# EAGLE design tb-4 (EAGLE 7.5.0)
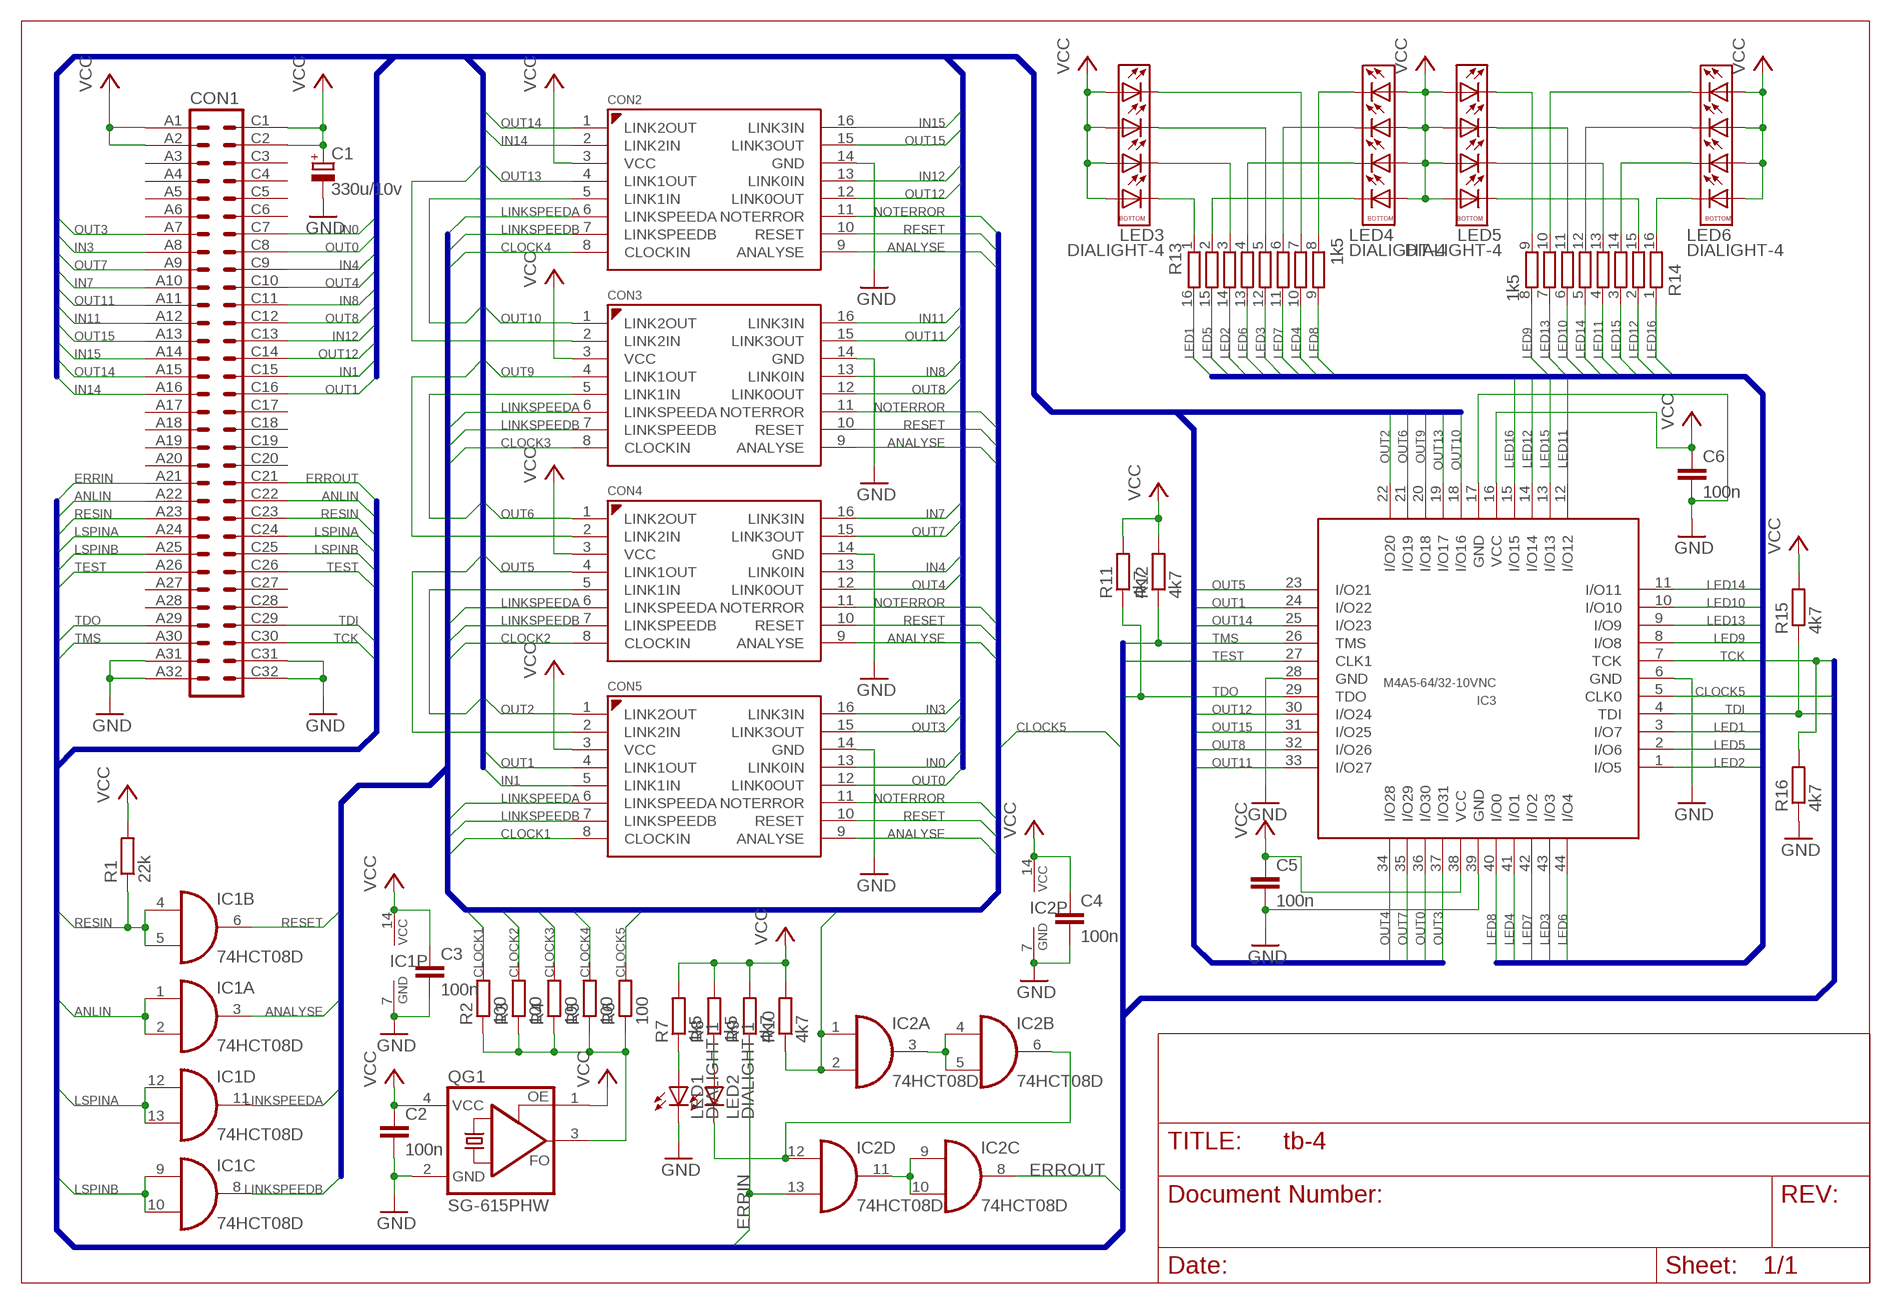
[diagram p0: schematic, sheet 1]

## Parts
C1  330u/10v  CPOL-EUSMCE  [SMC_E]
C2  100n  C-EUC1206  [C1206]
C3  100n  C-EUC1206  [C1206]
C4  100n  C-EUC1206  [C1206]
C5  100n  C-EUC1206  [C1206]
C6  100n  C-EUC1206  [C1206]
CON1  HARTING 09 03 164 6921  EUROPAKARTE-VG32-AC-TB4  [EUROPAKARTE-TB4]
CON2  TRAM-1  [TRAM-1-MB]
CON3  TRAM-1  [TRAM-1-MB]
CON4  TRAM-1  [TRAM-1-MB]
CON5  TRAM-1  [TRAM-1-MB]
IC1  74HCT08D  74HC08D  [SO14]
IC2  74HCT08D  74HC08D  [SO14]
IC3  M4A5-64/32-10VNC  LATTICE-M4A-6432  [TQFP-44]
LED1  DIALIGHT-1  [DIALIGHT-1]
LED2  DIALIGHT-1  [DIALIGHT-1]
LED3  DIALIGHT-4  [DIALIGHT-4]
LED4  DIALIGHT-4  [DIALIGHT-4]
LED5  DIALIGHT-4  [DIALIGHT-4]
LED6  DIALIGHT-4  [DIALIGHT-4]
QG1  SG-615PHW  [SG-615]
R1  22k  R-EU_R1206  [R1206]
R2  100  R-EU_R1206  [R1206]
R3  100  R-EU_R1206  [R1206]
R4  100  R-EU_R1206  [R1206]
R5  100  R-EU_R1206  [R1206]
R6  100  R-EU_R1206  [R1206]
R7  1k5  R-EU_R1206  [R1206]
R8  1k5  R-EU_R1206  [R1206]
R9  4k7  R-EU_R1206  [R1206]
R10  4k7  R-EU_R1206  [R1206]
R11  4k7  R-EU_R1206  [R1206]
R12  4k7  R-EU_R1206  [R1206]
R13  1k5  4816P-T01  [4816P]
R14  1k5  4816P-T01  [4816P]
R15  4k7  R-EU_R1206  [R1206]
R16  4k7  R-EU_R1206  [R1206]

## Nets
ANALYSE: CON2.9(ANALYSE) CON3.9(ANALYSE) CON4.9(ANALYSE) CON5.9(ANALYSE) IC1.3(A:O)
ANLIN: CON1.A22 CON1.C22 IC1.1(A:I0) IC1.2(A:I1)
CLOCK1: CON5.8(CLOCKIN) R2.2
CLOCK2: CON4.8(CLOCKIN) R3.2
CLOCK3: CON3.8(CLOCKIN) R4.2
CLOCK4: CON2.8(CLOCKIN) R5.2
CLOCK5: IC3.5(CLK0) R6.2
ERRIN: CON1.A21 IC2.13(D:I1) R9.1
ERROUT: CON1.C21 IC2.8(C:O)
GND: C1.- C2.2 C3.2 C4.2 C5.2 C6.2 CON1.A31 CON1.A32 CON1.C31 CON1.C32 CON2.14(GND) CON3.14(GND) CON4.14(GND) CON5.14(GND) IC1.7(P:GND) IC2.7(P:GND) IC3.6(GND) IC3.17(GND) IC3.28(GND) IC3.39(GND) LED1.C1(C) QG1.2(GND) R16.1
IN0: CON1.C7 CON5.13(LINK0IN)
IN1: CON1.C15 CON5.5(LINK1IN)
IN3: CON1.A8 CON5.16(LINK3IN)
IN4: CON1.C9 CON4.13(LINK0IN)
IN7: CON1.A10 CON4.16(LINK3IN)
IN8: CON1.C11 CON3.13(LINK0IN)
IN11: CON1.A12 CON3.16(LINK3IN)
IN12: CON1.C13 CON2.13(LINK0IN)
IN14: CON1.A16 CON2.2(LINK2IN)
IN15: CON1.A14 CON2.16(LINK3IN)
LED1: IC3.3(I/O7) R13.16
LED2: IC3.1(I/O5) R13.14
LED3: IC3.43(I/O3) R13.12
LED4: IC3.41(I/O1) R13.10
LED5: IC3.2(I/O6) R13.15
LED6: IC3.44(I/O4) R13.13
LED7: IC3.42(I/O2) R13.11
LED8: IC3.40(I/O0) R13.9
LED9: IC3.8(I/O8) R14.8
LED10: IC3.10(I/O10) R14.6
LED11: IC3.12(I/O12) R14.4
LED12: IC3.14(I/O14) R14.2
LED13: IC3.9(I/O9) R14.7
LED14: IC3.11(I/O11) R14.5
LED15: IC3.13(I/O13) R14.3
LED16: IC3.15(I/O15) R14.1
LINKSPEEDA: CON2.6(LINKSPEEDA) CON3.6(LINKSPEEDA) CON4.6(LINKSPEEDA) CON5.6(LINKSPEEDA) IC1.11(D:O)
LINKSPEEDB: CON2.7(LINKSPEEDB) CON3.7(LINKSPEEDB) CON4.7(LINKSPEEDB) CON5.7(LINKSPEEDB) IC1.8(C:O)
LSPINA: CON1.A24 CON1.C24 IC1.12(D:I0) IC1.13(D:I1)
LSPINB: CON1.A25 CON1.C25 IC1.9(C:I0) IC1.10(C:I1)
N$1: QG1.3(FO) R2.1 R3.1 R4.1 R5.1 R6.1
N$2: LED2.A1(A) R8.1
N$3: IC2.3(A:O) IC2.4(B:I0) IC2.5(B:I1)
N$4: LED1.A1(A) R7.1
N$5: LED3.C1 R13.1
N$6: LED4.C1 R13.2
N$7: LED3.C2 R13.3
N$8: LED4.C2 R13.4
N$9: LED4.C3 R13.6
N$10: LED4.C4 R13.8
N$11: LED3.C4 R13.7
N$12: LED3.C3 R13.5
N$13: LED5.C1 R14.15
N$14: LED6.C1 R14.16
N$15: LED6.C2 R14.14
N$16: LED5.C2 R14.13
N$17: LED6.C3 R14.12
N$18: LED5.C3 R14.11
N$19: LED6.C4 R14.10
N$20: LED5.C4 R14.9
N$22: IC2.9(C:I0) IC2.10(C:I1) IC2.11(D:O)
N$23: IC2.6(B:O) IC2.12(D:I0) LED2.C1(C)
NOTERROR: CON2.11(NOTERROR) CON3.11(NOTERROR) CON4.11(NOTERROR) CON5.11(NOTERROR) IC2.1(A:I0) IC2.2(A:I1) R10.1
OUT0: CON1.C8 CON5.12(LINK0OUT) IC3.36(I/O30)
OUT1: CON1.C16 CON5.4(LINK1OUT) IC3.24(I/O22)
OUT2: CON4.5(LINK1IN) CON5.1(LINK2OUT) IC3.22(I/O20)
OUT3: CON1.A7 CON5.15(LINK3OUT) IC3.37(I/O31)
OUT4: CON1.C10 CON4.12(LINK0OUT) IC3.34(I/O28)
OUT5: CON4.4(LINK1OUT) CON5.2(LINK2IN) IC3.23(I/O21)
OUT6: CON3.5(LINK1IN) CON4.1(LINK2OUT) IC3.21(I/O19)
OUT7: CON1.A9 CON4.15(LINK3OUT) IC3.35(I/O29)
OUT8: CON1.C12 CON3.12(LINK0OUT) IC3.32(I/O26)
OUT9: CON3.4(LINK1OUT) CON4.2(LINK2IN) IC3.20(I/O18)
OUT10: CON2.5(LINK1IN) CON3.1(LINK2OUT) IC3.18(I/O16)
OUT11: CON1.A11 CON3.15(LINK3OUT) IC3.33(I/O27)
OUT12: CON1.C14 CON2.12(LINK0OUT) IC3.30(I/O24)
OUT13: CON2.4(LINK1OUT) CON3.2(LINK2IN) IC3.19(I/O17)
OUT14: CON1.A15 CON2.1(LINK2OUT) IC3.25(I/O23)
OUT15: CON1.A13 CON2.15(LINK3OUT) IC3.31(I/O25)
RESET: CON2.10(RESET) CON3.10(RESET) CON4.10(RESET) CON5.10(RESET) IC1.6(B:O)
RESIN: CON1.A23 CON1.C23 IC1.4(B:I0) IC1.5(B:I1) R1.1
TCK: CON1.C30 IC3.7(TCK) R16.2
TDI: CON1.C29 IC3.4(TDI) R15.1
TDO: CON1.A29 IC3.29(TDO) R11.1
TEST: CON1.A26 CON1.C26 IC3.27(CLK1)
TMS: CON1.A30 IC3.26(TMS) R12.1
VCC: C1.+ C2.1 C3.1 C4.1 C5.1 C6.1 CON1.A1 CON1.A2 CON1.C1 CON1.C2 CON2.3(VCC) CON3.3(VCC) CON4.3(VCC) CON5.3(VCC) IC1.14(P:VCC) IC2.14(P:VCC) IC3.16(VCC) IC3.38(VCC) LED3.A1 LED3.A2 LED3.A3 LED3.A4 LED4.A1 LED4.A2 LED4.A3 LED4.A4 LED5.A1 LED5.A2 LED5.A3 LED5.A4 LED6.A1 LED6.A2 LED6.A3 LED6.A4 QG1.1(OE) QG1.4(VCC) R1.2 R7.2 R8.2 R9.2 R10.2 R11.2 R12.2 R15.2
Unconnected: CON1.A3 CON1.A4 CON1.A5 CON1.A6 CON1.A17 CON1.A18 CON1.A19 CON1.A20 CON1.A27 CON1.A28 CON1.C3 CON1.C4 CON1.C5 CON1.C6 CON1.C17 CON1.C18 CON1.C19 CON1.C20 CON1.C27 CON1.C28

## Buses
IN[0..15],OUT[0..15]
LINKSPEEDA,LINKSPEEDB,CLOCK[1..5],RESET,ANALYSE,NOTERROR
LED[1..16]
ERRIN,ERROUT,ANLIN,RESIN,LSPINA,LSPINB,TDI,TCK,TDO,TMS,TEST,CLOCK5

## Library data of the parts
C1 = rcl:CPOL-EU: POLARIZED CAPACITOR, European symbol
C2-C6 = rcl:C-EU: CAPACITOR, European symbol
CON1 = Transputer:EUROPAKARTE-VG32-AC
CON2-CON5 = Transputer:TRAM-1
IC1 IC2 = 74xx-eu:74*08: Quad 2-input AND gate
IC3 = Transputer:LATTICE-M4A-6432
LED1 LED2 = Transputer:DIALIGHT-1
LED3-LED6 = Transputer:DIALIGHT-4
QG1 = crystal:SG-615: SOJ HIGH-FREQUENCY CRYSTAL OSCILLATOR Source: Crystal Oscillator SG-615%20Series.pdf; OC_FARNELL: unknown; OC_NEWARK: unknown
R1-R12 R15 R16 = rcl:R-EU_: RESISTOR, European symbol
R13 R14 = resistor-bourns:4816P-T01: BOURNS RESISTOR NETWORK; MF: BOURNS, INC.; MPN: 4816P-T01-684LF; OC_FARNELL: 9357483; OC_NEWARK: 33K0707

## Board
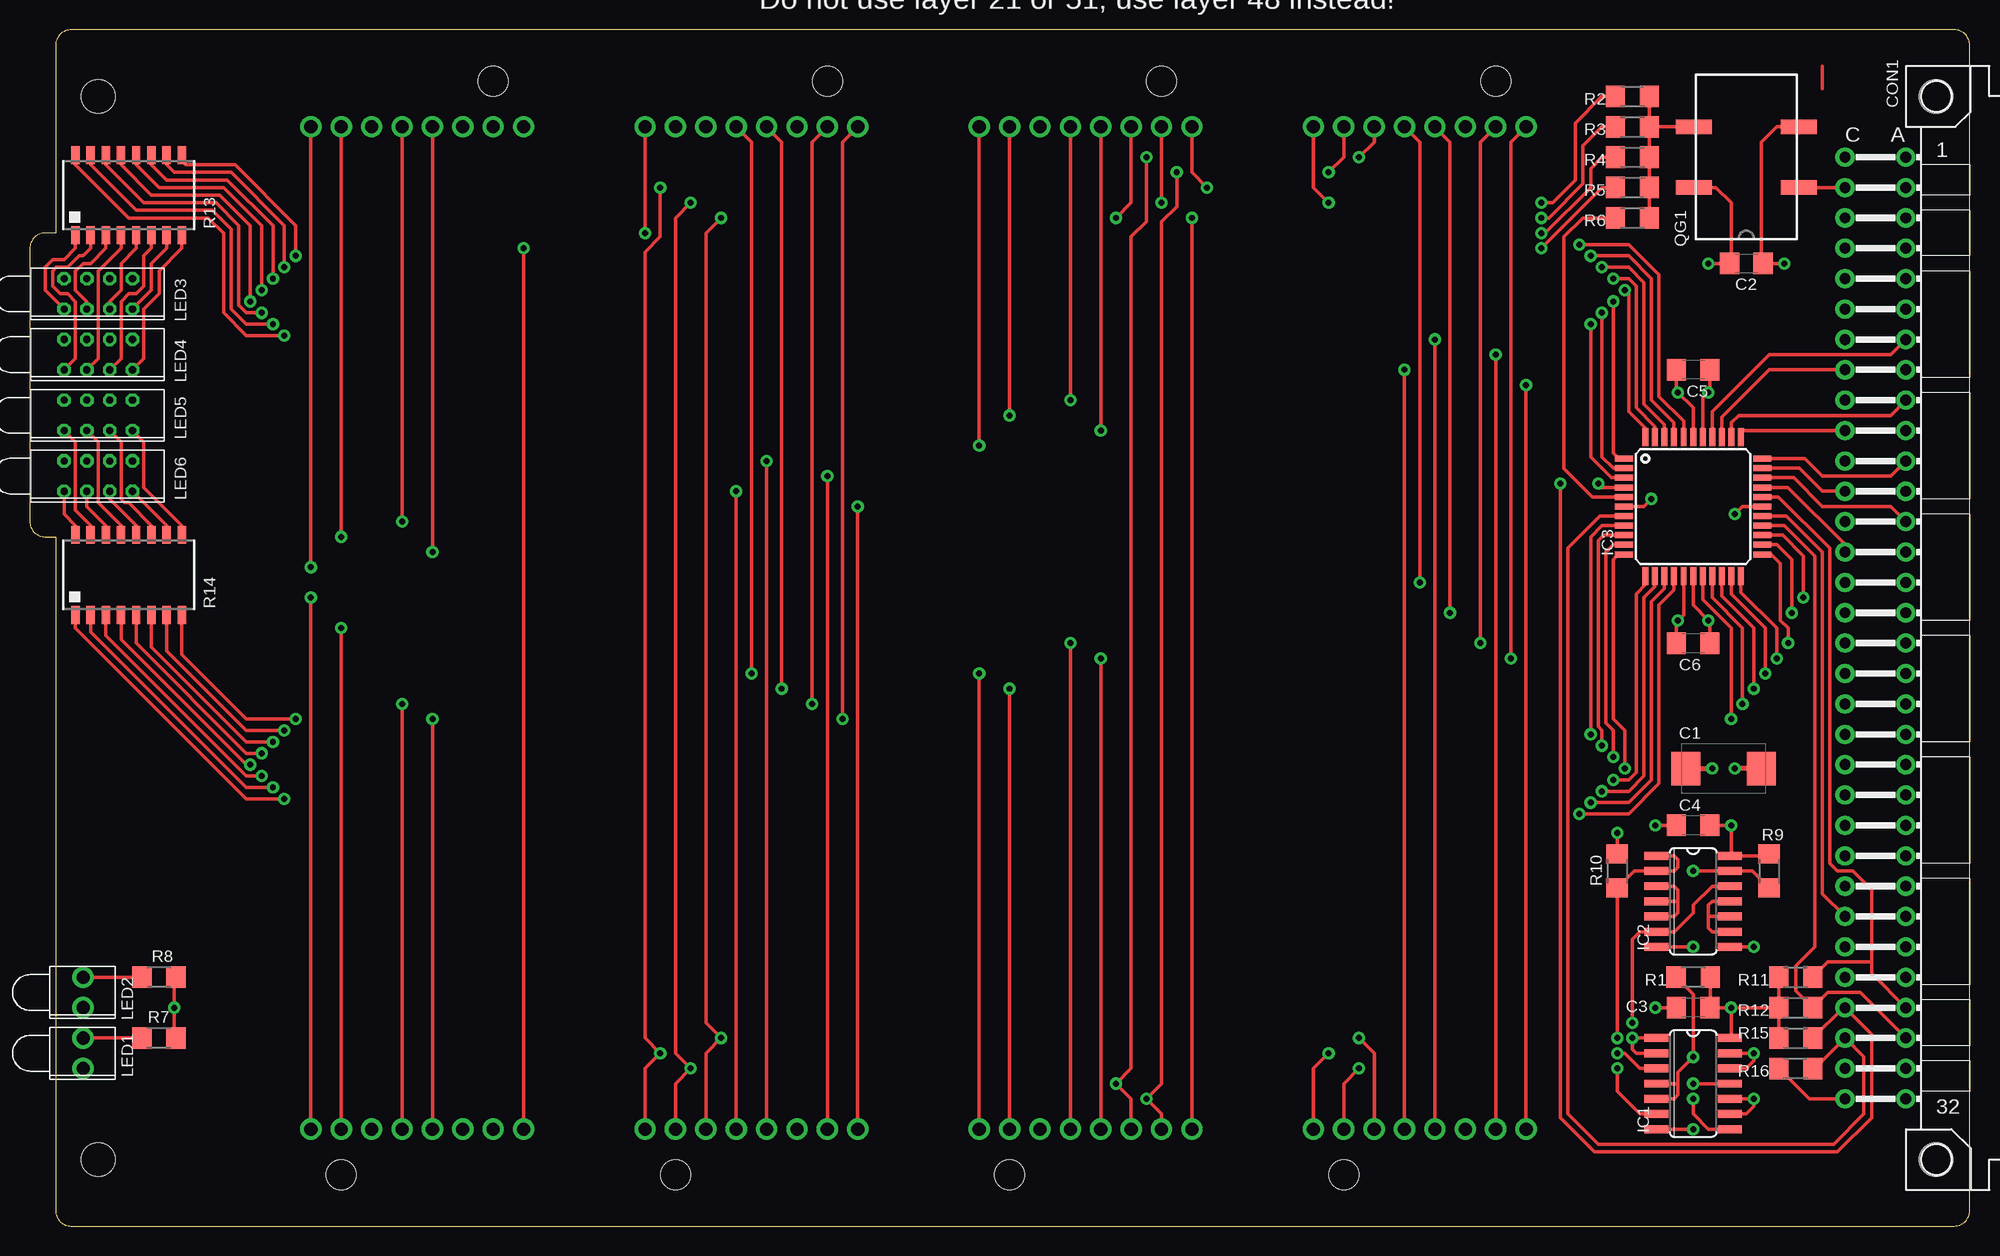
[diagram p1: board, top side]
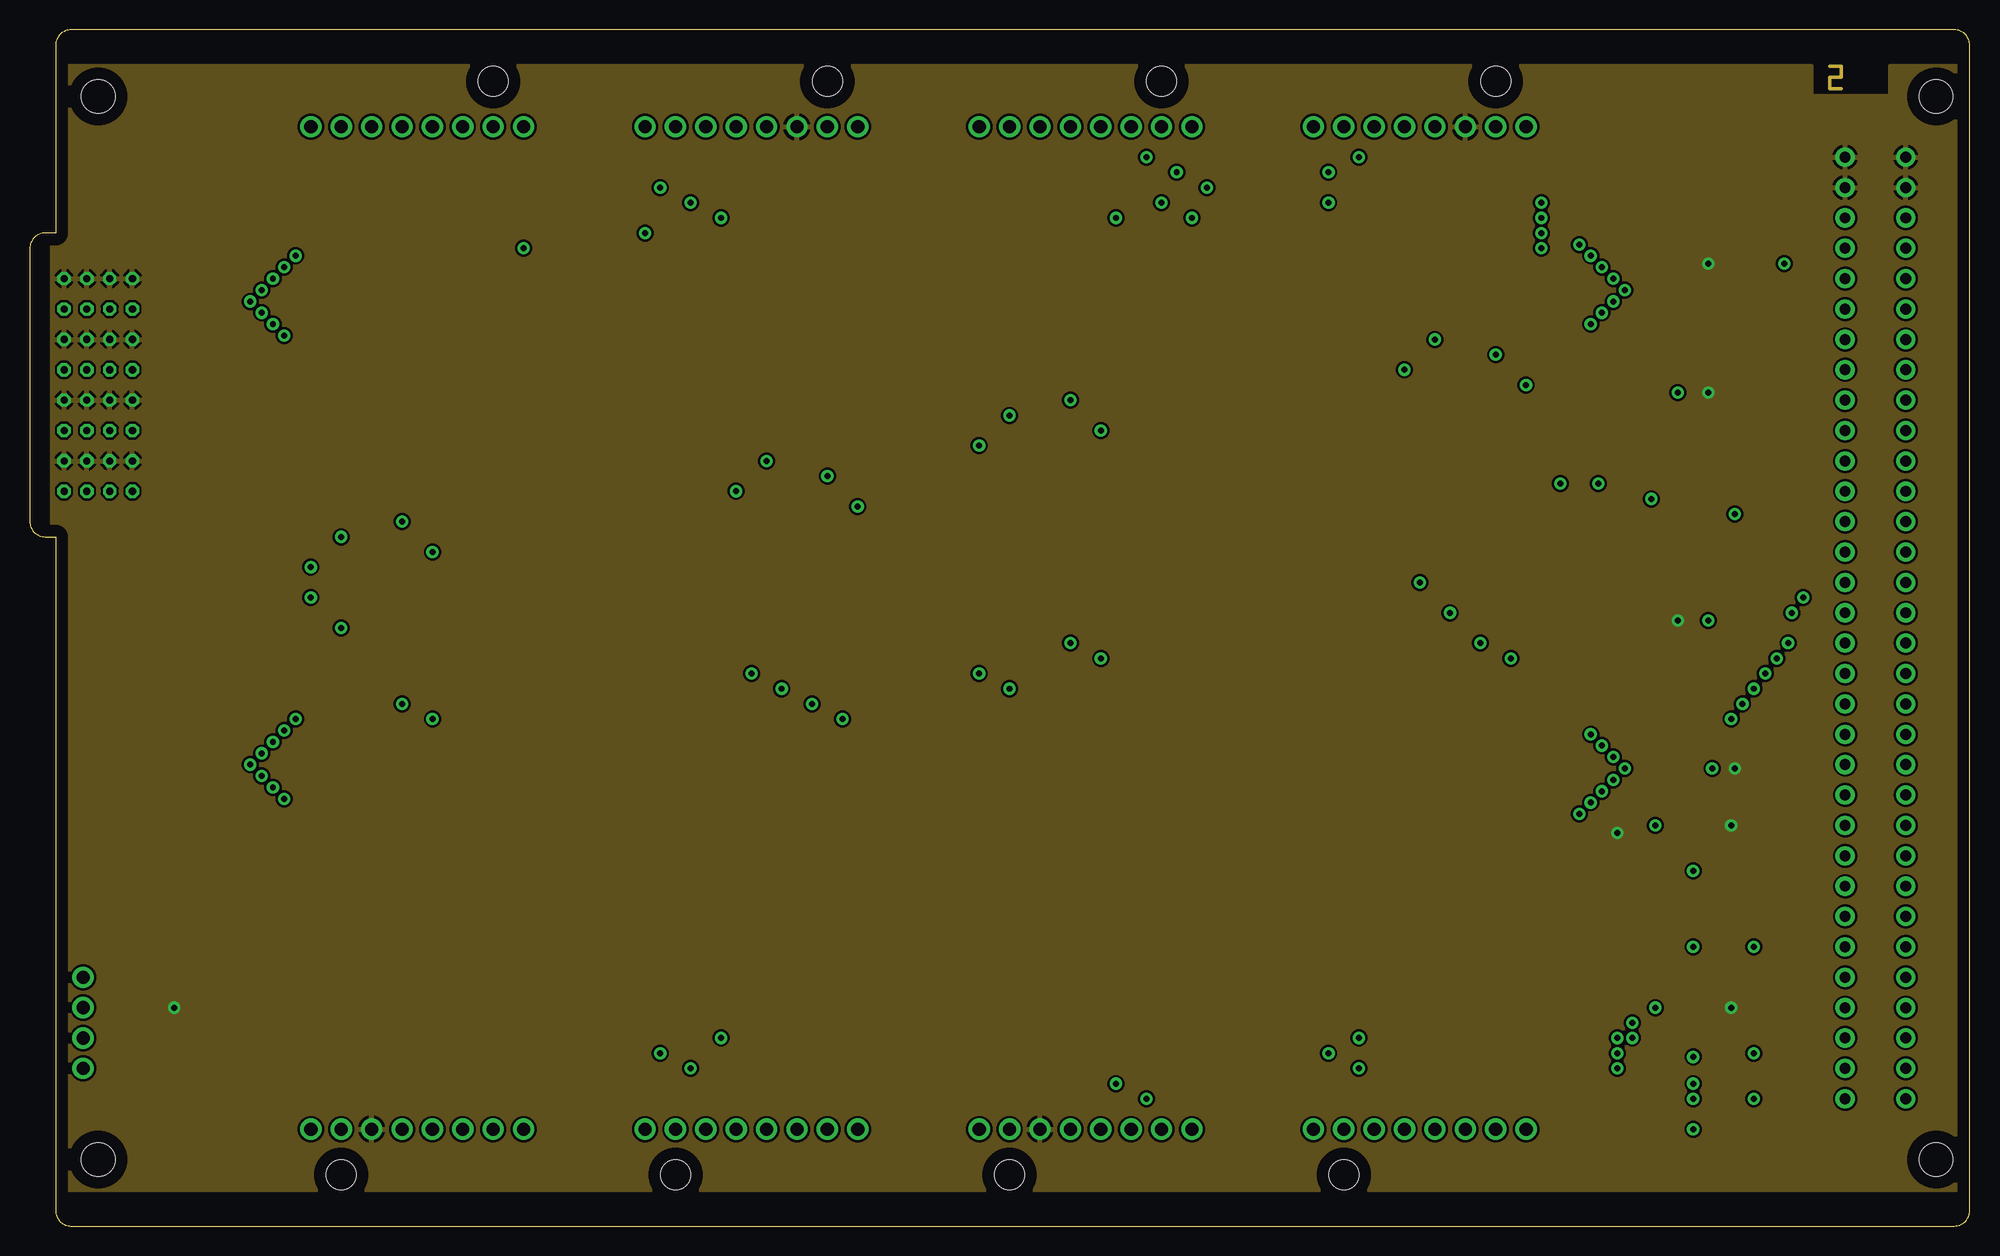
[diagram p2: board, inner layer Route2]
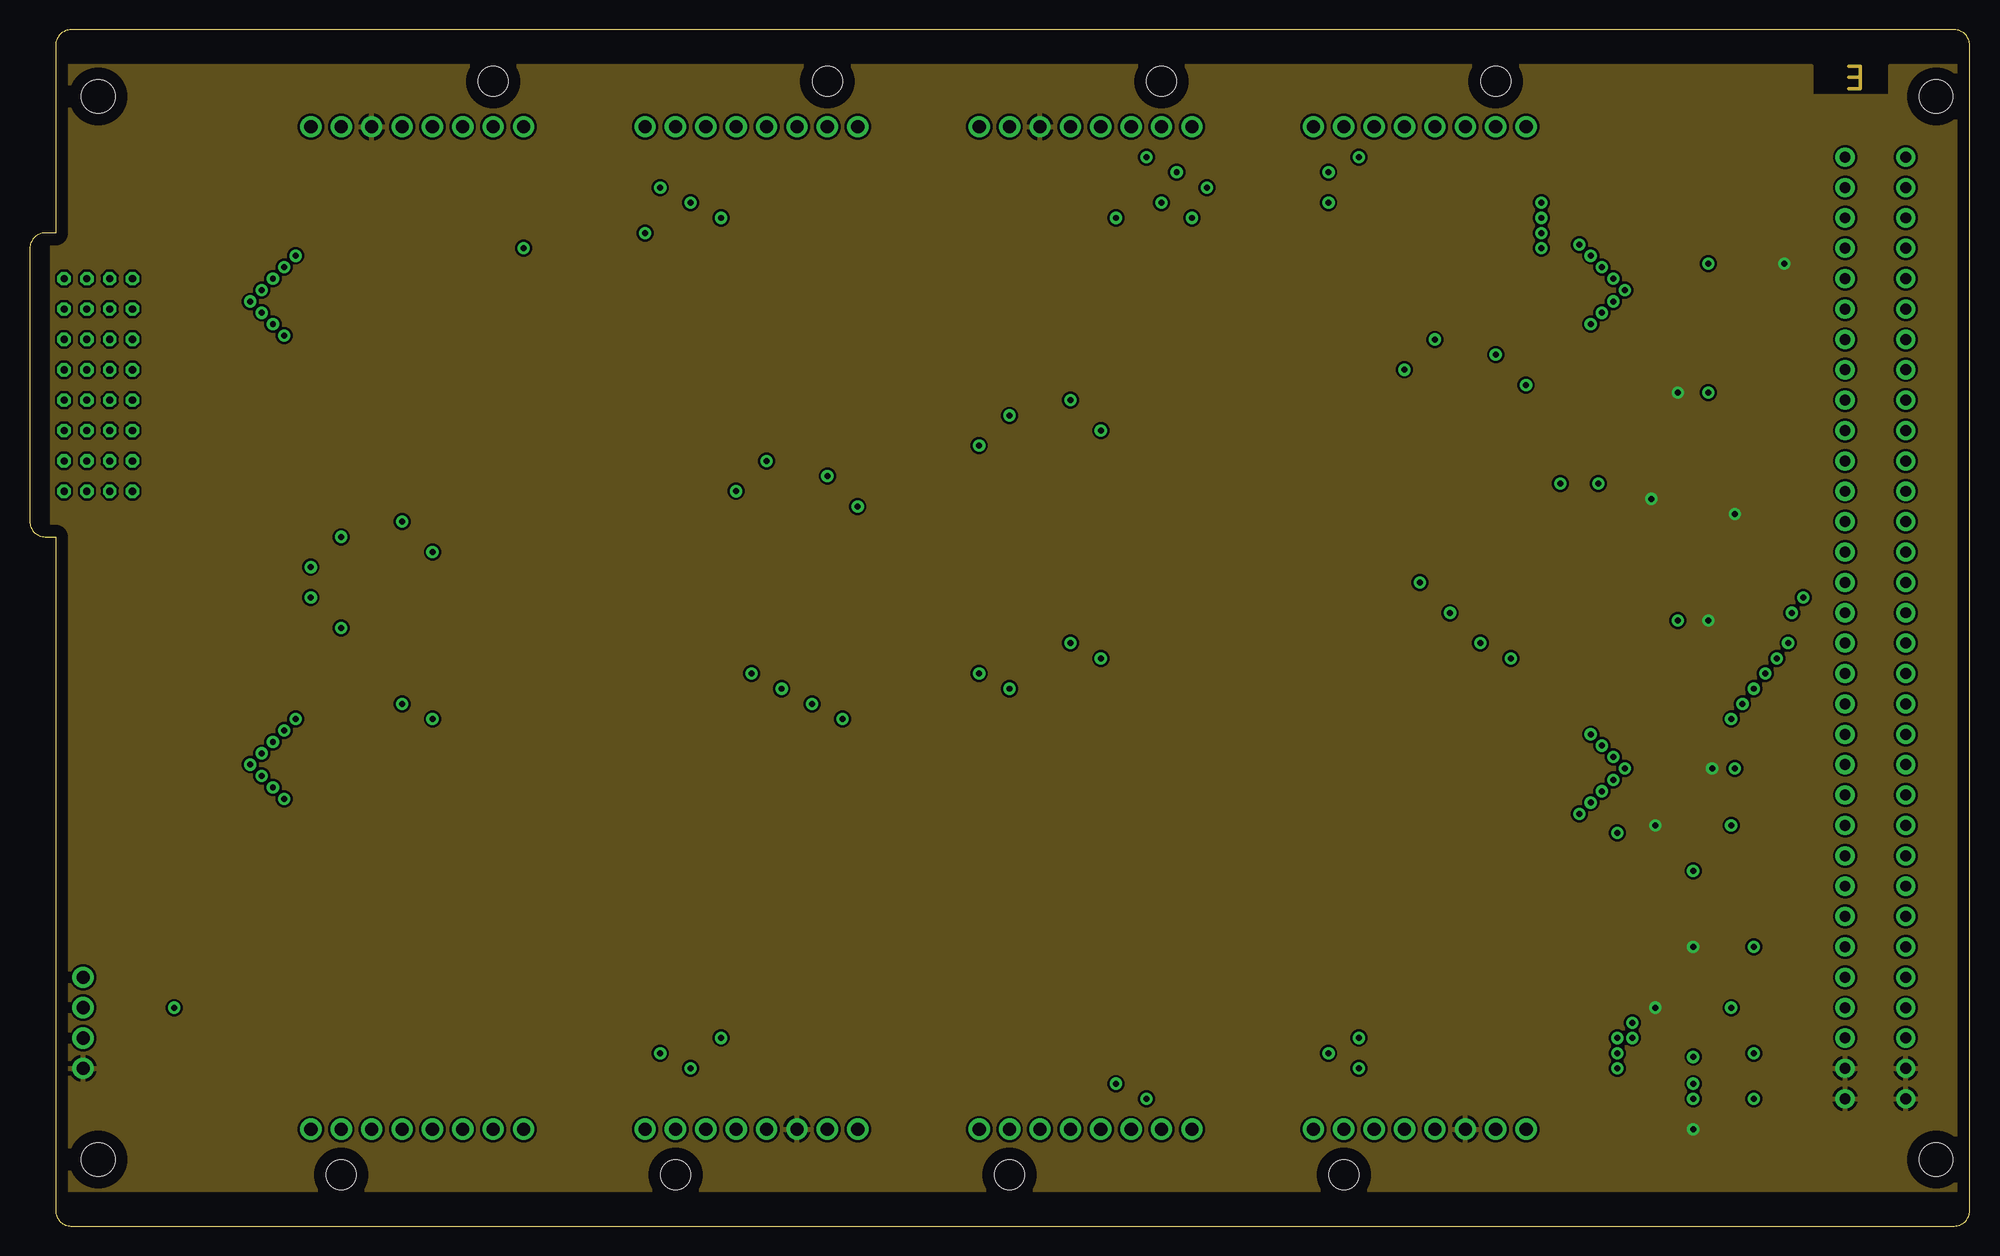
[diagram p3: board, inner layer Route15]
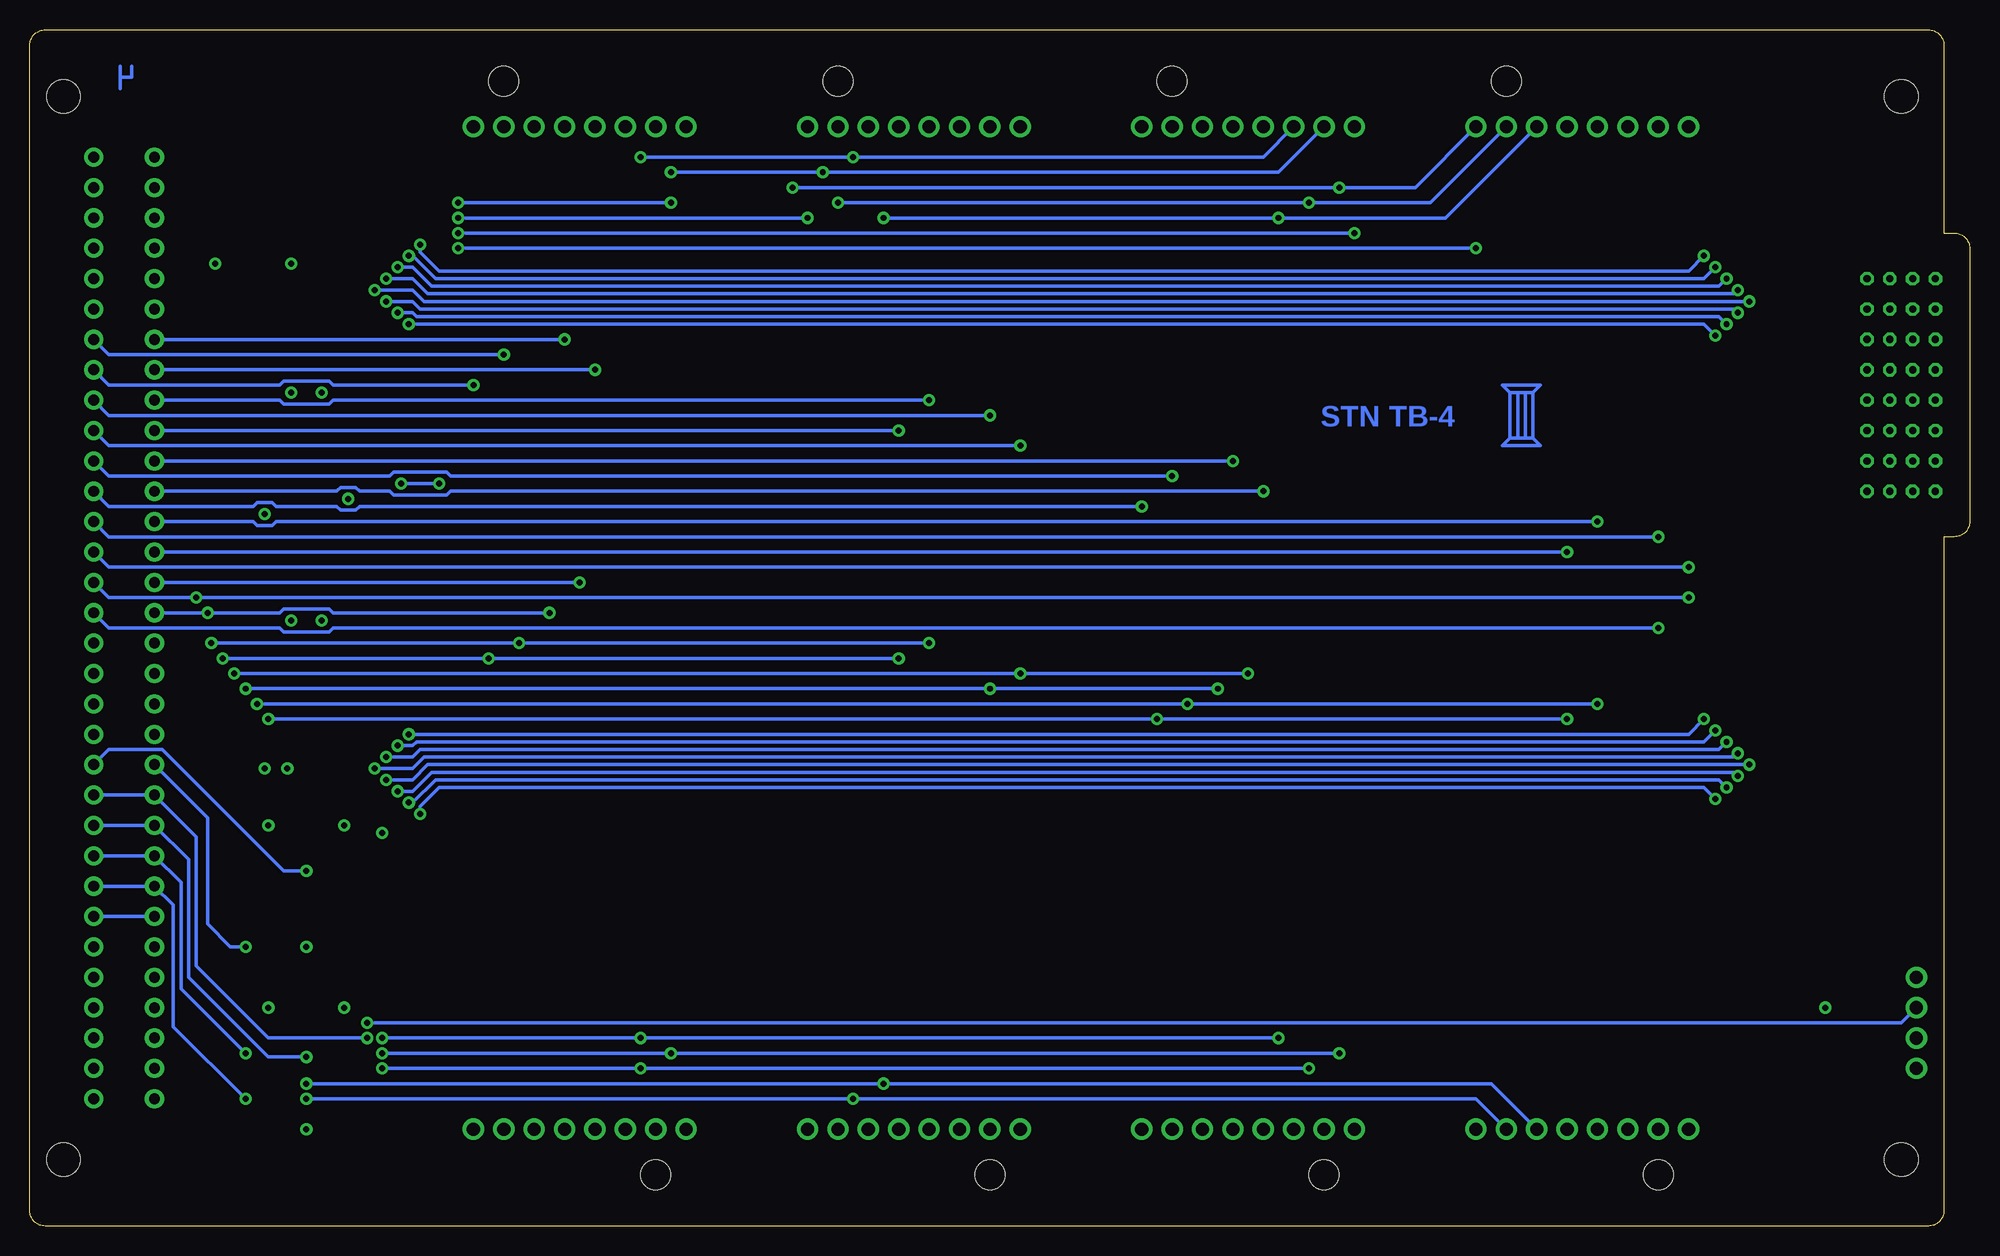
[diagram p4: board, bottom side, seen from below]

Size 162.18 x 100.03 mm. Coordinates in mm from the lower left corner, seen from the top.
Copper layers (1*2*15*16): Top 0.035mm / dielectric 1.5mm / Route2 0.035mm / dielectric 0.15mm / Route15 0.035mm / dielectric 0.2mm / Bottom 0.035mm
Design rules "default *": minimum track width 10mil, minimum drill 16mil, track to track 8mil, track to pad 8mil, pad to pad 8mil, via to via 8mil, smd to smd 8mil, copper to edge 40mil, drill to drill 8mil, minimum pad ring 10mil, minimum via ring 8mil, stop-mask expansion 4mil, vias tented up to drill 0mil, thermal gap 10mil

### Footprints (pad centres in the part's own frame; a part is rotated, then mirrored left to right if it is on the bottom)
SMC_E = smd 2.4 x 2.8: + -3.15,0; - 3.15,0
C1206 = smd 1.6 x 1.8: 1 -1.4,0; 2 1.4,0
EUROPAKARTE-TB4 = drill 0.914 pad 1.6: A1 71.12,39.37; A2 71.12,36.83; A3 71.12,34.29; A4 71.12,31.75; A5 71.12,29.21; A6 71.12,26.67; A7 71.12,24.13; A8 71.12,21.59; A9 71.12,19.05; A10 71.12,16.51; A11 71.12,13.97; A12 71.12,11.43; A13 71.12,8.89; A14 71.12,6.35; A15 71.12,3.81; A16 71.12,1.27; A17 71.12,-1.27; A18 71.12,-3.81; A19 71.12,-6.35; A20 71.12,-8.89; A21 71.12,-11.43; A22 71.12,-13.97; A23 71.12,-16.51; A24 71.12,-19.05; A25 71.12,-21.59; A26 71.12,-24.13; A27 71.12,-26.67; A28 71.12,-29.21; A29 71.12,-31.75; A30 71.12,-34.29; A31 71.12,-36.83; A32 71.12,-39.37; C1 66.04,39.37; C2 66.04,36.83; C3 66.04,34.29; C4 66.04,31.75; C5 66.04,29.21; C6 66.04,26.67; C7 66.04,24.13; C8 66.04,21.59; C9 66.04,19.05; C10 66.04,16.51; C11 66.04,13.97; C12 66.04,11.43; C13 66.04,8.89; C14 66.04,6.35; C15 66.04,3.81; C16 66.04,1.27; C17 66.04,-1.27; C18 66.04,-3.81; C19 66.04,-6.35; C20 66.04,-8.89; C21 66.04,-11.43; C22 66.04,-13.97; C23 66.04,-16.51; C24 66.04,-19.05; C25 66.04,-21.59; C26 66.04,-24.13; C27 66.04,-26.67; C28 66.04,-29.21; C29 66.04,-31.75; C30 66.04,-34.29; C31 66.04,-36.83; C32 66.04,-39.37 | hole 2.794: 73.66,44.45; 73.66,-44.45; -80.01,-44.45; -80.01,44.45
TRAM-1-MB = drill 1.1 pad 1.778: 1 0,0; 2 2.54,0; 3 5.08,0; 4 7.62,0; 5 10.16,0; 6 12.7,0; 7 15.24,0; 8 17.78,0; 9 17.78,83.82; 10 15.24,83.82; 11 12.7,83.82; 12 10.16,83.82; 13 7.62,83.82; 14 5.08,83.82; 15 2.54,83.82; 16 0,83.82 | hole 2.5: 2.54,-3.81; 15.24,87.63
SO14 = smd 0.66 x 2.032: 1 -3.81,-3.073; 2 -2.54,-3.073; 3 -1.27,-3.073; 4 0,-3.073; 5 1.27,-3.073; 6 2.54,-3.073; 7 3.81,-3.073; 8 3.81,3.073; 9 2.54,3.073; 10 1.27,3.073; 11 0,3.073; 12 -1.27,3.073; 13 -2.54,3.073; 14 -3.81,3.073
TQFP-44 = smd 1.5 x 0.5: 1 -5.8,4; 2 -5.8,3.2; 3 -5.8,2.4; 4 -5.8,1.6; 5 -5.8,0.8; 6 -5.8,0; 7 -5.8,-0.8; 8 -5.8,-1.6; 9 -5.8,-2.4; 10 -5.8,-3.2; 11 -5.8,-4; 23 5.8,-4; 24 5.8,-3.2; 25 5.8,-2.4; 26 5.8,-1.6; 27 5.8,-0.8; 28 5.8,0; 29 5.8,0.8; 30 5.8,1.6; 31 5.8,2.4; 32 5.8,3.2; 33 5.8,4 | smd 0.5 x 1.5: 12 -4,-5.8; 13 -3.2,-5.8; 14 -2.4,-5.8; 15 -1.6,-5.8; 16 -0.8,-5.8; 17 0,-5.8; 18 0.8,-5.8; 19 1.6,-5.8; 20 2.4,-5.8; 21 3.2,-5.8; 22 4,-5.8; 34 4,5.8; 35 3.2,5.8; 36 2.4,5.8; 37 1.6,5.8; 38 0.8,5.8; 39 0,5.8; 40 -0.8,5.8; 41 -1.6,5.8; 42 -2.4,5.8; 43 -3.2,5.8; 44 -4,5.8
DIALIGHT-1 = drill 1.1 pad 1.778: A1 0,1.27; C1 0,-1.27
DIALIGHT-4 = drill 0.6 pad 1.016 octagon: A1 0,1.27; A2 1.905,1.27; A3 3.81,1.27; A4 5.715,1.27; C1 0,-1.27; C2 1.905,-1.27; C3 3.81,-1.27; C4 5.715,-1.27
SG-615 = smd 1.2 x 3: 1 -2.54,-4.4; 2 2.54,-4.4; 3 2.54,4.4; 4 -2.54,4.4
R1206 = smd 1.6 x 1.803: 1 -1.422,0; 2 1.422,0
4816P = smd 0.7 x 1.5: 1 -4.445,-3.346; 2 -3.175,-3.346; 3 -1.905,-3.346; 4 -0.635,-3.346; 5 0.635,-3.346; 6 1.905,-3.346; 7 3.175,-3.346; 8 4.445,-3.346; 9 4.445,3.346; 10 3.175,3.346; 11 1.905,3.346; 12 0.635,3.346; 13 -0.635,3.346; 14 -1.905,3.346; 15 -3.175,3.346; 16 -4.445,3.346

### Placement (x,y rotation side)
C1  141.6,38.27 180 top
C2  143.51,80.49 0 top
C3  139.06,18.26 180 top
C4  139.06,33.5 180 top
C5  139.06,71.6 180 top
C6  139.06,48.74 0 top
CON1  85.72,50.01 0 top
CON2  23.5,8.1 0 top
CON3  69.22,91.92 180 top
CON4  79.38,8.1 0 top
CON5  125.09,91.92 180 top
IC1  139.06,11.91 270 top
IC2  139.06,27.15 270 top
IC3  139.06,60.17 0 top
LED1  4.45,14.45 0 top
LED2  4.45,19.53 0 top
LED3  2.86,77.95 0 top
LED4  2.86,72.87 0 top
LED5  2.86,67.79 0 top
LED6  2.86,62.71 0 top
QG1  143.51,89.38 90 top
R1  139.06,20.8 0 top
R2  133.99,94.46 180 top
R3  133.99,91.92 180 top
R4  133.99,89.38 180 top
R5  133.99,86.84 180 top
R6  133.99,84.3 180 top
R7  10.8,15.72 0 top
R8  10.8,20.8 0 top
R9  145.41,29.69 90 top
R10  132.72,29.69 90 top
R11  147.64,20.8 180 top
R12  147.64,18.26 180 top
R13  8.26,86.21 0 top
R14  8.26,54.46 0 top
R15  147.64,15.72 180 top
R16  147.64,13.18 0 top
U$2  [LOGO]  37.47,67.79 0 bottom
U$3  [LAYER14]  152.08,96.05 0 top

### Tracks (layer width: path | path; a pad name or v marks a point on that pad's centre or on a via)
ANALYSE  (via drill 0.5 pad 1.02)
  Top 0.305: CON3.9 51.44,13.18 v52.7,14.45 51.44,15.72 51.44,81.45 52.7,82.72 v52.7,86.84 | CON5.9 107.31,13.18 v108.59,14.45 | v98.42,86.84 97.16,88.11 CON4.9 | IC1.3 134.62,13.18 133.35,14.45 v132.72,14.45
  Bottom 0.305: v52.7,14.45 v108.59,14.45 v132.72,14.45 | CON2.9 46.36,86.84 v52.7,86.84 v98.42,86.84
ANLIN  (via drill 0.5 pad 1.02)
  Top 0.305: IC1.2 134.3,14.45 133.99,14.77 v133.99,15.72 IC1.1
  Bottom 0.305: v133.99,15.72 142.24,15.72 148.27,21.75 148.27,32.55 CON1.C22 CON1.A22
CLOCK1  (via drill 0.5 pad 1.02)
  Top 0.305: CON5.8 107.31,86.84 v108.59,85.57 | R2.2 131.44,94.46 129.22,92.24 129.22,87.48 127.32,85.57 v126.36,85.57
  Bottom 0.305: v108.59,85.57 v126.36,85.57
CLOCK2  (via drill 0.5 pad 1.02)
  Top 0.305: CON4.8 v97.16,84.3 | v126.36,84.3 127,84.3 129.86,87.16 129.86,90.33 131.44,91.92 R3.2
  Bottom 0.305: v97.16,84.3 v126.36,84.3
CLOCK3  (via drill 0.5 pad 1.02)
  Top 0.305: CON3.8 v51.44,83.03 | R4.2 131.44,89.38 130.49,88.43 130.49,86.84 126.68,83.03 v126.36,83.03
  Bottom 0.305: v51.44,83.03 v126.36,83.03
CLOCK4  (via drill 0.5 pad 1.02)
  Top 0.305: CON2.8 v41.27,81.76 | v126.36,81.76 131.44,86.84 R5.2
  Bottom 0.305: v41.27,81.76 v126.36,81.76
CLOCK5
  Top 0.305: IC3.5 130.65,60.97 128.27,63.35 128.27,82.72 129.86,84.3 R6.2
ERRIN  (via drill 0.5 pad 1.02)
  Top 0.305: v139.06,29.69 IC2.13 143.99,29.69 R9.1
  Bottom 0.305: CON1.A21 155.57,39.85 151.13,39.85 140.97,29.69 v139.06,29.69
ERROUT  (via drill 0.5 pad 1.02)
  Top 0.305: IC2.8 v144.15,23.34
  Bottom 0.305: CON1.C21 147.32,34.14 147.32,25.25 145.41,23.34 v144.15,23.34
GND  (via drill 0.5 pad 1.02)
  Top 0.305: QG1.2 146.05,91.92 144.78,90.65 144.78,80.62 | IC3.39 139.06,68.43 v137.79,69.7 137.66,69.83 C5.2 | IC3.6 134.94,60.17 v135.57,60.81 | IC3.28 143.19,60.17 v142.56,59.54 | IC3.17 139.06,51.92 v140.34,50.65 140.47,50.52 C6.2 | IC1.7 v139.06,8.1 | C3.2 v135.89,18.26 | C4.2 v135.89,33.5 | IC2.7 v139.06,23.34 | C2.2 v146.69,80.49 | R16.1 148.76,10.64 CON1.C32
  Top 0.406: C1.- v140.65,38.26
  Top 0.61: 144.78,80.62 C2.2
  pour Route15: 1.91,97 148.91,97 148.91,94.46 155.57,94.46 155.57,97 161.93,97 161.93,3.02 1.91,3.02
IN0  (via drill 0.5 pad 1.02)
  Top 0.305: v117.47,74.14 CON5.13
  Bottom 0.305: CON1.C7 v117.47,74.14
IN1  (via drill 0.5 pad 1.02)
  Top 0.305: CON5.5 116.2,90.65 v116.2,53.82
  Bottom 0.305: CON1.C15 v116.2,53.82
IN3  (via drill 0.5 pad 1.02)
  Top 0.305: v125.09,70.33 CON5.16
  Bottom 0.305: CON1.A8 155.57,70.33 141.29,70.33 140.97,70.65 137.16,70.65 136.84,70.33 v125.09,70.33
IN4  (via drill 0.5 pad 1.02)
  Top 0.305: CON4.13 v87,69.06
  Bottom 0.305: CON1.C9 141.29,69.06 140.97,68.75 137.16,68.75 136.84,69.06 v87,69.06
IN7  (via drill 0.5 pad 1.02)
  Top 0.305: CON4.16 v79.38,65.25
  Bottom 0.305: CON1.A10 155.57,65.25 v79.38,65.25
IN8  (via drill 0.5 pad 1.02)
  Top 0.305: CON3.13 v61.59,63.98
  Bottom 0.305: CON1.C11 v61.59,63.98
IN11  (via drill 0.5 pad 1.02)
  Top 0.305: CON3.16 v69.22,60.17
  Bottom 0.305: CON1.A12 155.57,60.17 143.51,60.17 143.19,60.49 141.92,60.49 141.6,60.17 136.53,60.17 136.21,59.85 134.94,59.85 134.62,60.17 v69.22,60.17
IN12  (via drill 0.5 pad 1.02)
  Top 0.305: CON2.13 v31.12,58.9
  Bottom 0.305: CON1.C13 143.51,58.9 143.19,58.58 141.92,58.58 141.6,58.9 v31.12,58.9
IN14  (via drill 0.5 pad 1.02)
  Top 0.305: CON2.2 v26.04,50.01
  Bottom 0.305: CON1.A16 155.57,50.01 141.29,50.01 140.97,49.69 137.16,49.69 136.84,50.01 v26.04,50.01
IN15  (via drill 0.5 pad 1.02)
  Top 0.305: CON2.16 v23.5,55.09
  Bottom 0.305: CON1.A14 155.57,55.09 v23.5,55.09
LED1  (via drill 0.5 pad 1.02)
  Top 0.305: R13.16 3.81,88.75 8.26,84.3 14.92,84.3 16.19,83.03 16.19,76.36 18.1,74.46 v21.27,74.46 | IC3.3 132.22,62.57 130.49,64.3 v130.49,75.41
  Bottom 0.305: v21.27,74.46 22.23,75.41 v130.49,75.41
LED2  (via drill 0.5 pad 1.02)
  Top 0.305: R13.14 6.35,88.75 9.53,85.57 15.56,85.57 17.46,83.67 17.46,77 18.1,76.36 v19.37,76.36 | IC3.1 132.84,64.17 132.4,64.62 v132.4,77.32
  Bottom 0.305: v19.37,76.36 19.69,76.68 129.54,76.68 130.18,77.32 v132.4,77.32
LED3  (via drill 0.5 pad 1.02)
  Top 0.305: R13.12 8.89,88.75 10.8,86.84 16.19,86.84 19.37,83.67 v19.37,78.27 | IC3.43 135.87,66.86 134.3,68.43 134.3,78.59 133.67,79.22 v132.4,79.22
  Bottom 0.305: v19.37,78.27 19.69,77.95 128.91,77.95 130.18,79.22 v132.4,79.22
LED4  (via drill 0.5 pad 1.02)
  Top 0.305: R13.10 11.43,88.75 12.07,88.11 16.83,88.11 21.27,83.67 v21.27,80.18 | IC3.41 137.47,67.17 135.57,69.06 135.57,79.22 133.67,81.13 v130.49,81.13
  Bottom 0.305: v21.27,80.18 22.23,79.22 128.27,79.22 130.18,81.13 v130.49,81.13
LED5  (via drill 0.5 pad 1.02)
  Top 0.305: R13.15 5.08,88.75 8.89,84.94 15.24,84.94 16.83,83.35 16.83,76.68 18.1,75.41 v20.32,75.41 | IC3.2 132.37,63.37 131.44,64.3 v131.44,76.36
  Bottom 0.305: v20.32,75.41 20.96,76.05 129.86,76.05 130.18,76.36 v131.44,76.36
LED6  (via drill 0.5 pad 1.02)
  Top 0.305: R13.13 7.62,88.75 10.16,86.21 15.88,86.21 18.42,83.67 v18.42,77.32 | IC3.44 135.06,66.71 133.67,68.11 133.67,77.95 v133.35,78.27
  Bottom 0.305: v18.42,77.32 129.22,77.32 130.18,78.27 v133.35,78.27
LED7  (via drill 0.5 pad 1.02)
  Top 0.305: R13.11 10.16,88.75 11.43,87.48 16.51,87.48 20.32,83.67 v20.32,79.22 | IC3.42 136.66,67.02 134.94,68.75 134.94,78.9 133.67,80.18 v131.44,80.18
  Bottom 0.305: v20.32,79.22 20.96,78.59 128.59,78.59 130.18,80.18 v131.44,80.18
LED8  (via drill 0.5 pad 1.02)
  Top 0.305: R13.9 12.7,89.07 13.02,88.75 17.15,88.75 22.23,83.67 v22.23,81.13 | IC3.40 138.27,67.32 136.21,69.38 136.21,79.54 133.67,82.08 v129.54,82.08
  Bottom 0.305: v22.23,81.13 23.5,79.86 127.95,79.86 129.54,81.45 v129.54,82.08
LED9  (via drill 0.5 pad 1.02)
  Top 0.305: R14.8 12.7,47.79 18.1,42.39 v22.23,42.39 | IC3.8 131.43,58.57 130.49,57.63 v130.49,41.12
  Bottom 0.305: v22.23,42.39 23.5,41.12 v130.49,41.12
LED10  (via drill 0.5 pad 1.02)
  Top 0.305: R14.6 10.16,48.43 18.1,40.49 v20.32,40.49 | IC3.10 132.37,56.97 131.76,56.36 131.76,42.07 132.4,41.44 v132.4,39.22
  Bottom 0.305: v20.32,40.49 20.96,39.85 129.54,39.85 130.18,39.22 v132.4,39.22
LED11  (via drill 0.5 pad 1.02)
  Top 0.305: R14.4 7.62,49.06 18.1,38.58 v18.42,38.58 | IC3.12 135.06,53.63 134.3,52.87 134.3,37.95 133.67,37.31 v132.4,37.31
  Bottom 0.305: v18.42,38.58 128.91,38.58 130.18,37.31 v132.4,37.31
LED12  (via drill 0.5 pad 1.02)
  Top 0.305: R14.2 5.08,49.69 18.1,36.68 v20.32,36.68 | IC3.14 136.66,53.33 135.57,52.24 135.57,37.31 133.67,35.41 v130.49,35.41
  Bottom 0.305: v20.32,36.68 20.96,37.31 128.27,37.31 130.18,35.41 v130.49,35.41
LED13  (via drill 0.5 pad 1.02)
  Top 0.305: R14.7 11.43,48.11 18.1,41.44 v21.27,41.44 | IC3.9 131.59,57.77 131.13,57.32 131.13,41.76 131.44,41.44 v131.44,40.17
  Bottom 0.305: v21.27,41.44 22.23,40.49 129.86,40.49 130.18,40.17 v131.44,40.17
LED14  (via drill 0.5 pad 1.02)
  Top 0.305: R14.5 8.89,48.74 18.1,39.54 v19.37,39.54 | IC3.11 132.84,56.17 132.4,55.73 132.4,42.39 133.35,41.44 v133.35,38.26
  Bottom 0.305: v19.37,39.54 19.69,39.22 129.22,39.22 130.18,38.26 v133.35,38.26
LED15  (via drill 0.5 pad 1.02)
  Top 0.305: R14.3 6.35,49.38 18.1,37.63 v19.37,37.63 | IC3.13 135.87,53.48 134.94,52.55 134.94,37.63 133.67,36.36 v131.44,36.36
  Bottom 0.305: v19.37,37.63 19.69,37.95 128.59,37.95 130.18,36.36 v131.44,36.36
LED16  (via drill 0.5 pad 1.02)
  Top 0.305: R14.1 3.81,50.01 18.1,35.73 v21.27,35.73 | IC3.15 137.47,53.18 136.21,51.92 136.21,36.99 133.67,34.46 v129.54,34.46
  Bottom 0.305: v21.27,35.73 22.23,36.68 127.95,36.68 129.54,35.09 v129.54,34.46
LINKSPEEDA  (via drill 0.5 pad 1.02)
  Top 0.305: CON4.6 92.08,10.64 v90.81,11.91 92.08,13.18 92.08,82.72 93.34,83.98 v93.34,89.38 | CON5.6 112.39,90.65 v111.12,89.38 | IC1.11 v139.06,11.91
  Bottom 0.305: CON2.6 40.01,11.91 v90.81,11.91 v139.06,11.91 | CON3.6 59.05,89.38 v93.34,89.38 v111.12,89.38
LINKSPEEDB  (via drill 0.5 pad 1.02)
  Top 0.305: CON4.7 94.61,9.37 v93.34,10.64 94.61,11.91 94.61,83.98 95.89,85.25 v95.89,88.11 | v108.59,88.11 109.86,89.38 CON5.7 | IC1.8 140.34,8.1 139.06,9.37 v139.06,10.64
  Bottom 0.305: CON2.7 41.27,10.64 v93.34,10.64 v139.06,10.64 | CON3.7 57.79,88.11 v95.89,88.11 v108.59,88.11
LSPINA  (via drill 0.5 pad 1.02)
  Top 0.305: IC1.12 143.51,13.18 144.15,13.82 v144.15,14.45 IC1.13
  Bottom 0.305: v144.15,14.45 149.54,19.85 149.54,28.74 CON1.C24 CON1.A24
LSPINB  (via drill 0.5 pad 1.02)
  Top 0.305: IC1.9 143.51,9.37 144.15,10.01 v144.15,10.64 IC1.10
  Bottom 0.305: v144.15,10.64 150.18,16.68 150.18,26.84 CON1.C25 CON1.A25
N$1
  Top 0.305: R3.1 R2.1 | R3.1 R4.1 R5.1 R6.1 | QG1.3 R3.1
N$2
  Top 0.305: 9.53,20.8 R8.1 LED2.A1
N$3
  Top 0.305: IC2.5 137.48,25.88 137.79,26.2 137.79,27.15 | 137.79,27.15 IC2.4 | IC2.3 137.48,28.42 137.79,28.11 137.79,27.15
N$4
  Top 0.305: R7.1 LED1.A1
N$5
  Top 0.305: LED3.C1 1.27,78.27 1.27,80.18 1.91,80.81 2.86,80.81 3.81,81.76 R13.1
N$6
  Top 0.305: R13.2 5.08,81.76 4.45,81.13 4.13,81.13 3.18,80.18 2.22,80.18 1.91,79.86 1.91,78.59 2.54,77.95 3.18,77.95 3.81,77.32 3.81,72.56 LED4.C1
N$7
  Top 0.305: LED3.C2 4.76,77.32 3.81,78.27 3.81,79.86 4.45,80.49 5.08,80.49 6.35,81.76 R13.3
N$8
  Top 0.305: LED4.C2 5.72,72.56 5.72,79.86 7.62,81.76 R13.4
N$9
  Top 0.305: LED4.C3 7.62,72.56 7.62,77.32 8.26,77.95 8.89,77.95 9.53,78.59 9.53,81.13 10.16,81.76 R13.6
N$10
  Top 0.305: R13.8 12.7,81.76 10.8,79.86 10.8,77.95 9.53,76.68 9.53,72.56 LED4.C4
N$11
  Top 0.305: LED3.C4 10.16,78.27 10.16,80.49 11.43,81.76 R13.7
N$12
  Top 0.305: LED3.C3 6.67,77.32 7.62,78.27 7.62,80.49 8.89,81.76 R13.5
N$13
  Top 0.305: R14.15 5.08,58.58 3.81,59.85 3.81,65.57 LED5.C1
N$14
  Top 0.305: LED6.C1 2.86,59.54 3.81,58.58 R14.16
N$15
  Top 0.305: R14.14 6.35,58.58 4.76,60.17 LED6.C2
N$16
  Top 0.305: R14.13 7.62,58.58 5.72,60.49 5.72,65.57 LED5.C2
N$17
  Top 0.305: LED6.C3 6.67,60.81 8.89,58.58 R14.12
N$18
  Top 0.305: LED5.C3 7.62,65.57 7.62,60.81 7.94,60.49 8.26,60.49 10.16,58.58 R14.11
N$19
  Top 0.305: R14.10 11.43,58.58 LED6.C4
N$20
  Top 0.305: LED5.C4 9.53,65.57 9.53,61.76 12.7,58.58 R14.9
N$22
  Top 0.305: IC2.9 140.65,24.61 140.34,24.93 140.34,25.88 | 140.34,25.88 IC2.10 | IC2.11 140.65,27.15 140.34,26.84 140.34,25.88
N$23  (via drill 0.5 pad 1.02)
  Top 0.305: v133.99,16.99 133.99,23.98 134.62,24.61 IC2.6 137.48,24.61 139.06,26.2 139.06,26.84 140.65,28.42 IC2.12
  Bottom 0.305: LED2.C1 5.72,16.99 v133.99,16.99
NOTERROR  (via drill 0.5 pad 1.02)
  Top 0.305: CON3.11 56.52,14.45 v57.79,15.72 56.52,16.99 56.52,83.03 v57.79,84.3 | CON5.11 112.39,14.45 v111.12,15.72 | v90.81,84.3 92.08,85.57 CON4.11 | v132.72,15.72 R10.1 134.14,29.69 IC2.2 137.48,29.69 137.79,30.01 137.79,30.65 137.48,30.96 IC2.1
  Bottom 0.305: v57.79,15.72 v111.12,15.72 v132.72,15.72 | CON2.11 43.81,84.3 v57.79,84.3 v90.81,84.3
OUT0  (via drill 0.5 pad 1.02)
  Top 0.305: v114.94,71.6 CON5.12 | IC3.36 141.47,67.65 145.41,71.6 CON1.C8
  Bottom 0.305: CON1.C8 v114.94,71.6
OUT1  (via drill 0.5 pad 1.02)
  Top 0.305: CON5.4 118.75,90.65 v118.75,51.28 | IC3.24 146.07,56.97 147.32,55.73 v147.32,51.28
  Bottom 0.305: CON1.C16 v147.32,51.28 141.29,51.28 140.97,51.6 137.16,51.6 136.84,51.28 v118.75,51.28
OUT2  (via drill 0.5 pad 1.02)
  Top 0.305: CON4.5 v89.53,47.47 | v123.83,47.47 123.83,90.65 CON5.1 | IC3.22 143.06,53 146.05,50.01 v146.05,47.47
  Bottom 0.305: v89.53,47.47 v123.83,47.47 v146.05,47.47
OUT3  (via drill 0.5 pad 1.02)
  Top 0.305: CON5.15 v122.56,72.87 | CON1.A7 155.57,72.87 145.41,72.87 140.66,68.12 IC3.37
  Bottom 0.305: CON1.A7 155.57,72.87 v122.56,72.87
OUT4  (via drill 0.5 pad 1.02)
  Top 0.305: CON4.12 v89.53,66.52 | IC3.34 143.06,66.52 CON1.C10
  Bottom 0.305: CON1.C10 v89.53,66.52
OUT5  (via drill 0.5 pad 1.02)
  Top 0.305: CON4.4 v87,48.74 | CON5.2 121.28,90.65 v121.28,48.74 | IC3.23 145.6,56.17 146.37,55.41 146.37,50.65 147,50.01 v147,48.74
  Bottom 0.305: v87,48.74 v121.28,48.74 v147,48.74
OUT6  (via drill 0.5 pad 1.02)
  Top 0.305: CON4.1 v79.38,46.2 | v60.33,46.2 60.33,90.65 CON3.5 | IC3.21 142.27,52.85 145.1,50.01 v145.1,46.2
  Bottom 0.305: v60.33,46.2 v79.38,46.2 v145.1,46.2
OUT7  (via drill 0.5 pad 1.02)
  Top 0.305: CON4.15 v81.92,67.79 | CON1.A9 155.57,67.79 151.45,67.79 151.13,67.79 142.88,67.79 142.27,67.18 IC3.35
  Bottom 0.305: CON1.A9 155.57,67.79 v81.92,67.79
OUT8  (via drill 0.5 pad 1.02)
  Top 0.305: CON3.12 v59.05,61.44 | IC3.32 147.93,63.37 149.86,61.44 CON1.C12
  Bottom 0.305: CON1.C12 136.53,61.44 136.21,61.76 134.94,61.76 134.62,61.44 132.08,61.44 131.76,61.13 127.32,61.13 127,61.44 v59.05,61.44
OUT9  (via drill 0.5 pad 1.02)
  Top 0.305: CON3.4 62.87,90.65 v62.87,44.93 | v81.92,44.93 CON4.2 | IC3.20 141.47,52.69 144.15,50.01 v144.15,44.93
  Bottom 0.305: v62.87,44.93 v81.92,44.93 v144.15,44.93
OUT10  (via drill 0.5 pad 1.02)
  Top 0.305: CON3.1 67.95,90.65 v67.95,42.39 | CON2.5 v33.66,42.39 | IC3.18 139.87,52.39 142.24,50.01 v142.24,42.39
  Bottom 0.305: v33.66,42.39 v67.95,42.39 v142.24,42.39
OUT11  (via drill 0.5 pad 1.02)
  Top 0.305: CON3.15 v66.67,62.71 | CON1.A11 155.57,62.71 149.86,62.71 148.4,64.17 IC3.33
  Bottom 0.305: CON1.A11 155.57,62.71 132.08,62.71 131.76,63.03 127.32,63.03 127,62.71 v66.67,62.71
OUT12  (via drill 0.5 pad 1.02)
  Top 0.305: CON2.12 v33.66,56.36 | IC3.30 146.99,61.77 151.77,57 CON1.C14
  Bottom 0.305: CON1.C14 v33.66,56.36
OUT13  (via drill 0.5 pad 1.02)
  Top 0.305: CON3.2 65.41,90.65 v65.41,43.66 | CON2.4 v31.12,43.66 | IC3.19 140.66,52.54 143.19,50.01 v143.19,43.66
  Bottom 0.305: v31.12,43.66 v65.41,43.66 v143.19,43.66
OUT14  (via drill 0.5 pad 1.02)
  Top 0.305: v23.5,52.55 CON2.1 | IC3.25 146.54,57.77 148.27,56.04 v148.27,52.55
  Bottom 0.305: CON1.A15 155.57,52.55 v148.27,52.55 v23.5,52.55
OUT15  (via drill 0.5 pad 1.02)
  Top 0.305: CON2.15 v26.04,57.63 | IC3.31 147.46,62.57 149.86,60.17 155.57,60.17 CON1.A13
  Bottom 0.305: CON1.A13 155.57,57.63 v26.04,57.63
RESET  (via drill 0.5 pad 1.02)
  Top 0.305: CON3.10 53.98,11.91 v55.25,13.18 53.98,14.45 53.98,84.3 v55.25,85.57 | CON5.10 109.86,11.91 v111.12,13.18 | v94.61,85.57 CON4.10 | IC1.6 134.62,9.37 132.72,11.28 v132.72,13.18
  Bottom 0.305: v55.25,13.18 v111.12,13.18 v132.72,13.18 | CON2.10 45.09,85.57 v55.25,85.57 v94.61,85.57
RESIN  (via drill 0.5 pad 1.02)
  Top 0.305: IC1.5 137.48,10.64 137.79,10.96 137.79,11.91 | 137.79,11.91 137.79,12.86 v139.06,14.14 139.06,19.38 R1.1 | IC1.4 137.79,11.91
  Bottom 0.305: v139.06,14.14 142.24,14.14 148.91,20.8 148.91,30.65 CON1.C23 CON1.A23
TCK
  Top 0.305: IC3.7 131.28,59.37 128.59,56.68 128.59,9.37 131.13,6.83 150.81,6.83 153.35,9.37 153.35,14.14 CON1.C30 149.22,13.18 R16.2
TDI  (via drill 0.5 pad 1.02)
  Top 0.305: IC3.4 131.46,61.77 131.44,61.76 v131.13,62.08 | v127.95,62.08 127.95,9.05 130.81,6.2 151.13,6.2 153.99,9.05 153.99,16.04 CON1.C29 151.6,18.26 R15.1
  Bottom 0.305: v131.13,62.08 v127.95,62.08
TDO
  Top 0.305: IC3.29 146.2,60.97 150.5,56.68 150.5,30.33 151.13,29.69 152.4,29.69 153.99,28.11 153.99,22.07 | CON1.A29 153.99,21.12 153.99,22.07 | R11.1 150.33,22.07 153.99,22.07
TEST
  Top 0.305: IC3.27 146.85,59.37 149.86,56.36 149.86,27.79 CON1.C26
  Bottom 0.305: CON1.A26 CON1.C26
TMS
  Top 0.305: IC3.26 146.7,58.57 149.22,56.04 149.22,23.34 147.64,21.75 147.64,19.68 R12.1 150.33,19.53 153.03,19.53 CON1.A30
VCC  (via drill 0.5 pad 1.02)
  Top 0.305: R8.2 12.07,20.65 v12.07,18.26 12.07,15.87 R7.2 | CON1.C2 QG1.1 | IC3.38 139.87,69.23 v140.34,69.7 140.47,69.83 C5.1 | IC3.16 138.27,51.12 v137.79,50.65 137.66,50.52 C6.1 | v142.24,18.26 C3.1 140.49,18.28 R1.2 | R10.2 v132.72,32.87 | C4.1 v142.24,33.5 142.24,30.96 IC2.14 145.26,30.96 R9.2 | QG1.4 140.97,86.84 142.24,85.57 142.24,80.62 | C2.1 142.24,80.62 | 142.24,80.62 142.24,80.49 v140.34,80.49 | R11.2 R12.2 | R15.2 R12.2 | R12.2 v142.24,18.26 | v142.24,18.26 142.24,15.72 IC1.14
  Top 0.406: C1.+ v142.56,38.26
  pour Route2: 1.91,97 148.91,97 148.91,94.46 155.57,94.46 155.57,97 161.93,97 161.93,3.02 1.91,3.02

### Text on the board
Bottom: STN TB-4
tPlace: Do not use layer 21 or 51, use layer 48 instead!
Document: SLOT 4 | SLOT 3 | SLOT 2 | SLOT 1
tDocu: Do not use layer 21 or 51, use layer 48 instead!